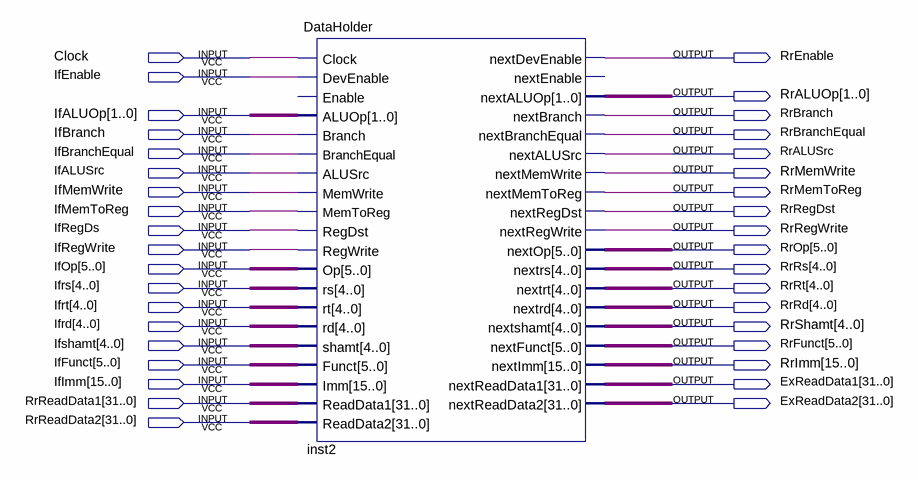
[diagram p0: schematic sheet]
// Quartus schematic RrStage.bdf as structural Verilog: 1 symbols, 37 pins
module RrStage (
  input  Clock,
  input  IfEnable,
  input  [1:0] IfALUOp,
  input  IfBranch,
  input  IfBranchEqual,
  input  IfALUSrc,
  input  IfMemWrite,
  input  IfMemToReg,
  input  IfRegDs,
  input  IfRegWrite,
  input  [5:0] IfOp,
  input  [4:0] Ifrs,
  input  [4:0] Ifrt,
  input  [4:0] Ifrd,
  input  [4:0] Ifshamt,
  input  [5:0] IfFunct,
  input  [15:0] IfImm,
  input  [31:0] RrReadData1,
  input  [31:0] RrReadData2,
  output RrEnable,
  output [1:0] RrALUOp,
  output RrBranch,
  output RrBranchEqual,
  output RrALUSrc,
  output RrMemWrite,
  output RrMemToReg,
  output RrRegDst,
  output RrRegWrite,
  output [5:0] RrOp,
  output [4:0] RrRs,
  output [4:0] RrRt,
  output [4:0] RrRd,
  output [4:0] RrShamt,
  output [5:0] RrFunct,
  output [15:0] RrImm,
  output [31:0] ExReadData1,
  output [31:0] ExReadData2
);

  DataHolder inst2 (
    .Clock(Clock), .DevEnable(IfEnable), .ALUOp(IfALUOp), .Branch(IfBranch), .BranchEqual(IfBranchEqual),
    .ALUSrc(IfALUSrc), .MemWrite(IfMemWrite), .MemToReg(IfMemToReg), .RegDst(IfRegDs), .RegWrite(IfRegWrite),
    .Op(IfOp), .rs(Ifrs), .rt(Ifrt), .rd(Ifrd), .shamt(Ifshamt), .Funct(IfFunct), .Imm(IfImm),
    .ReadData1(RrReadData1), .ReadData2(RrReadData2), .nextDevEnable(RrEnable), .nextALUOp(RrALUOp),
    .nextBranch(RrBranch), .nextBranchEqual(RrBranchEqual), .nextALUSrc(RrALUSrc), .nextMemWrite(RrMemWrite),
    .nextMemToReg(RrMemToReg), .nextRegDst(RrRegDst), .nextRegWrite(RrRegWrite), .nextOp(RrOp),
    .nextrs(RrRs), .nextrt(RrRt), .nextrd(RrRd), .nextshamt(RrShamt), .nextFunct(RrFunct), .nextImm(RrImm),
    .nextReadData1(ExReadData1), .nextReadData2(ExReadData2));  // open: Enable, nextEnable
endmodule
